# Altium schematic sheet main.SchDoc
size A0
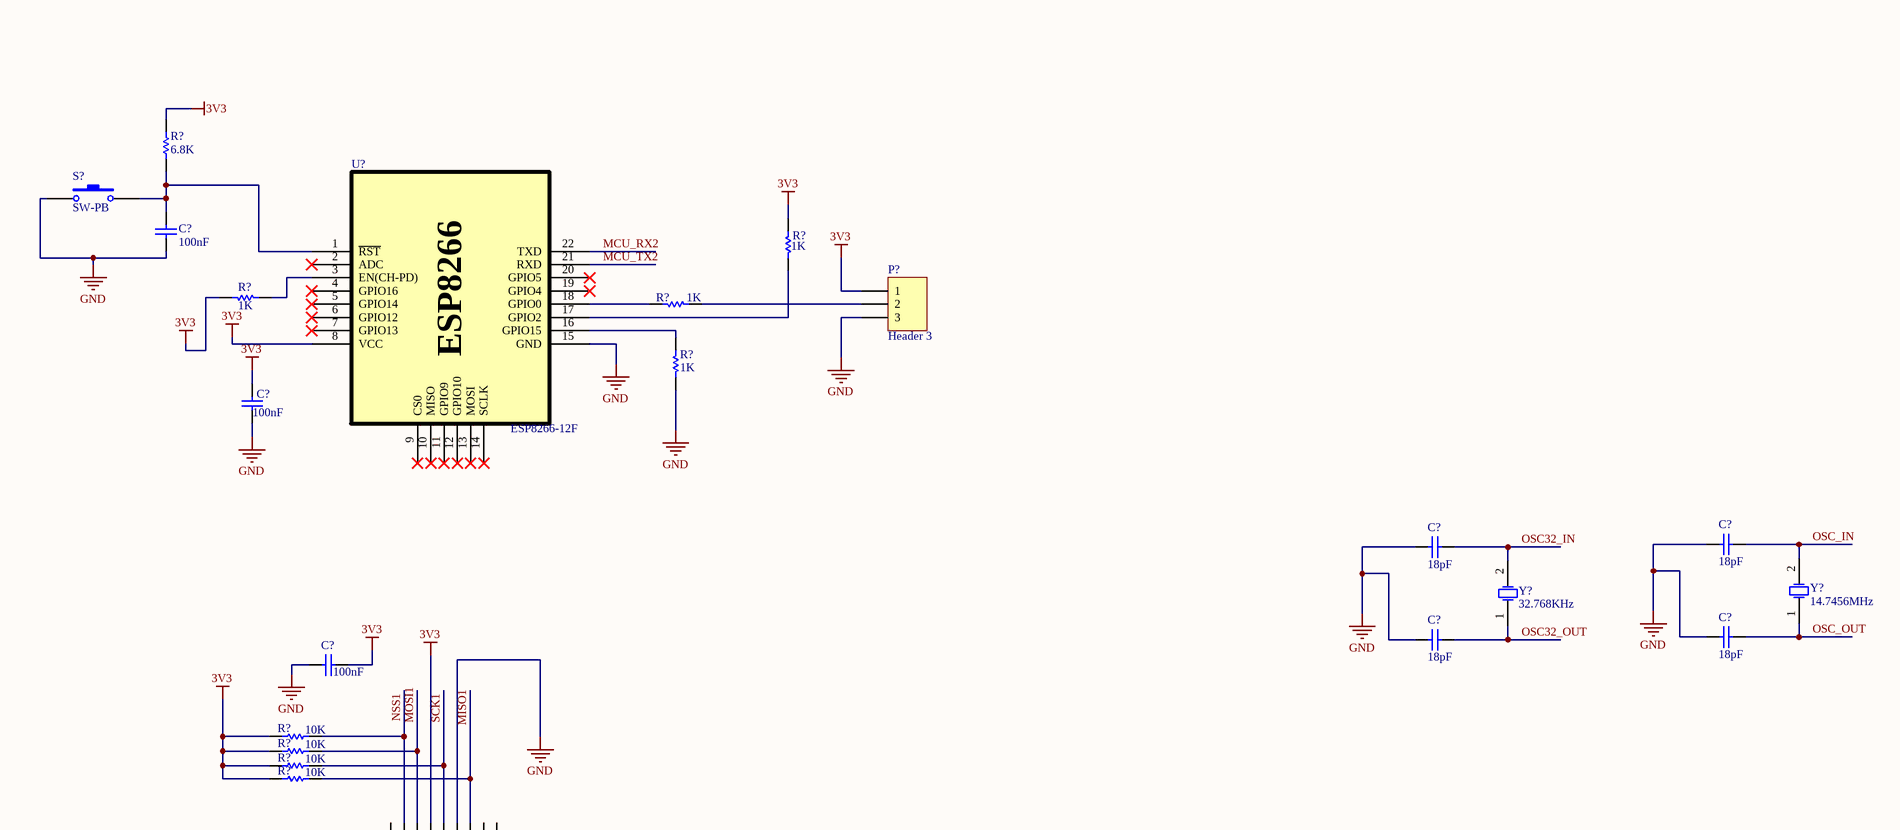
[diagram p0: main.SchDoc, top left]
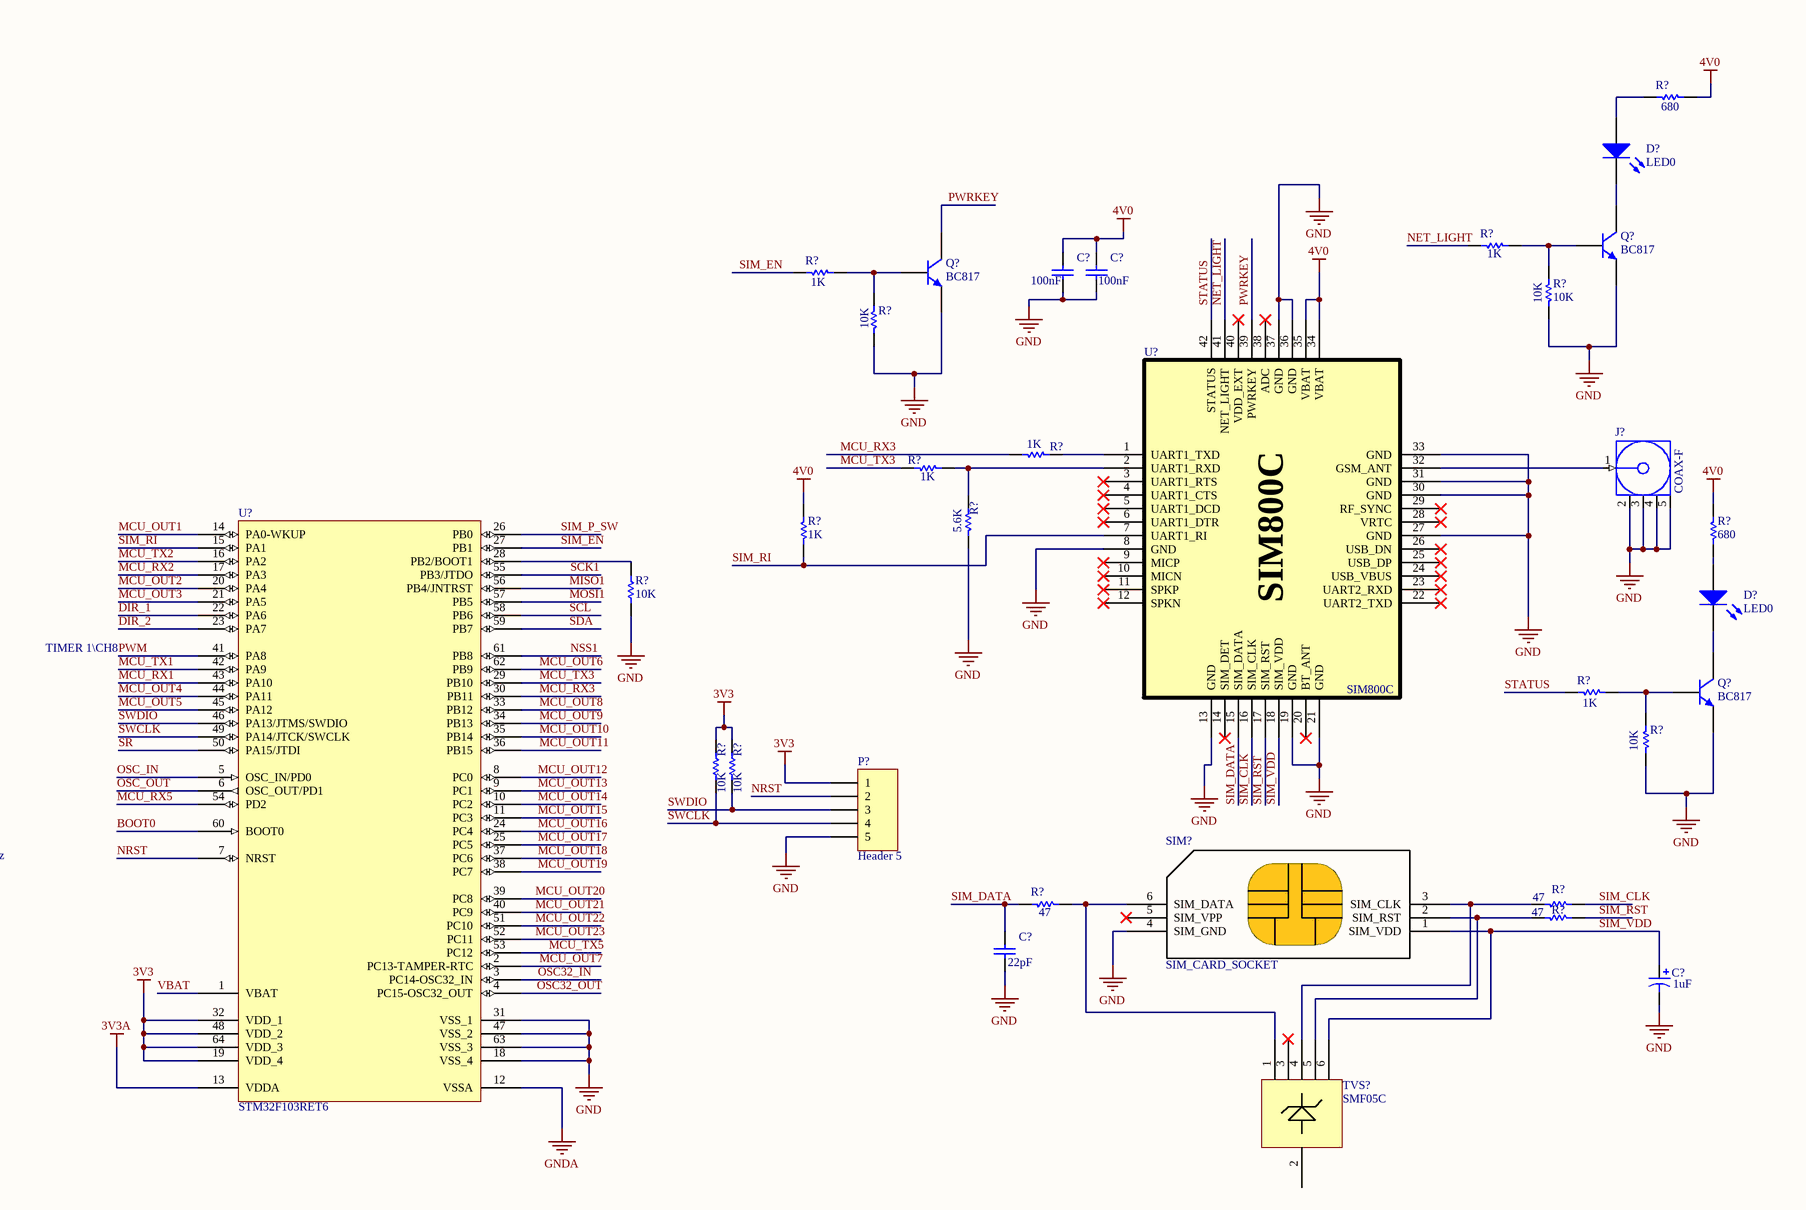
[diagram p1: main.SchDoc, top right]
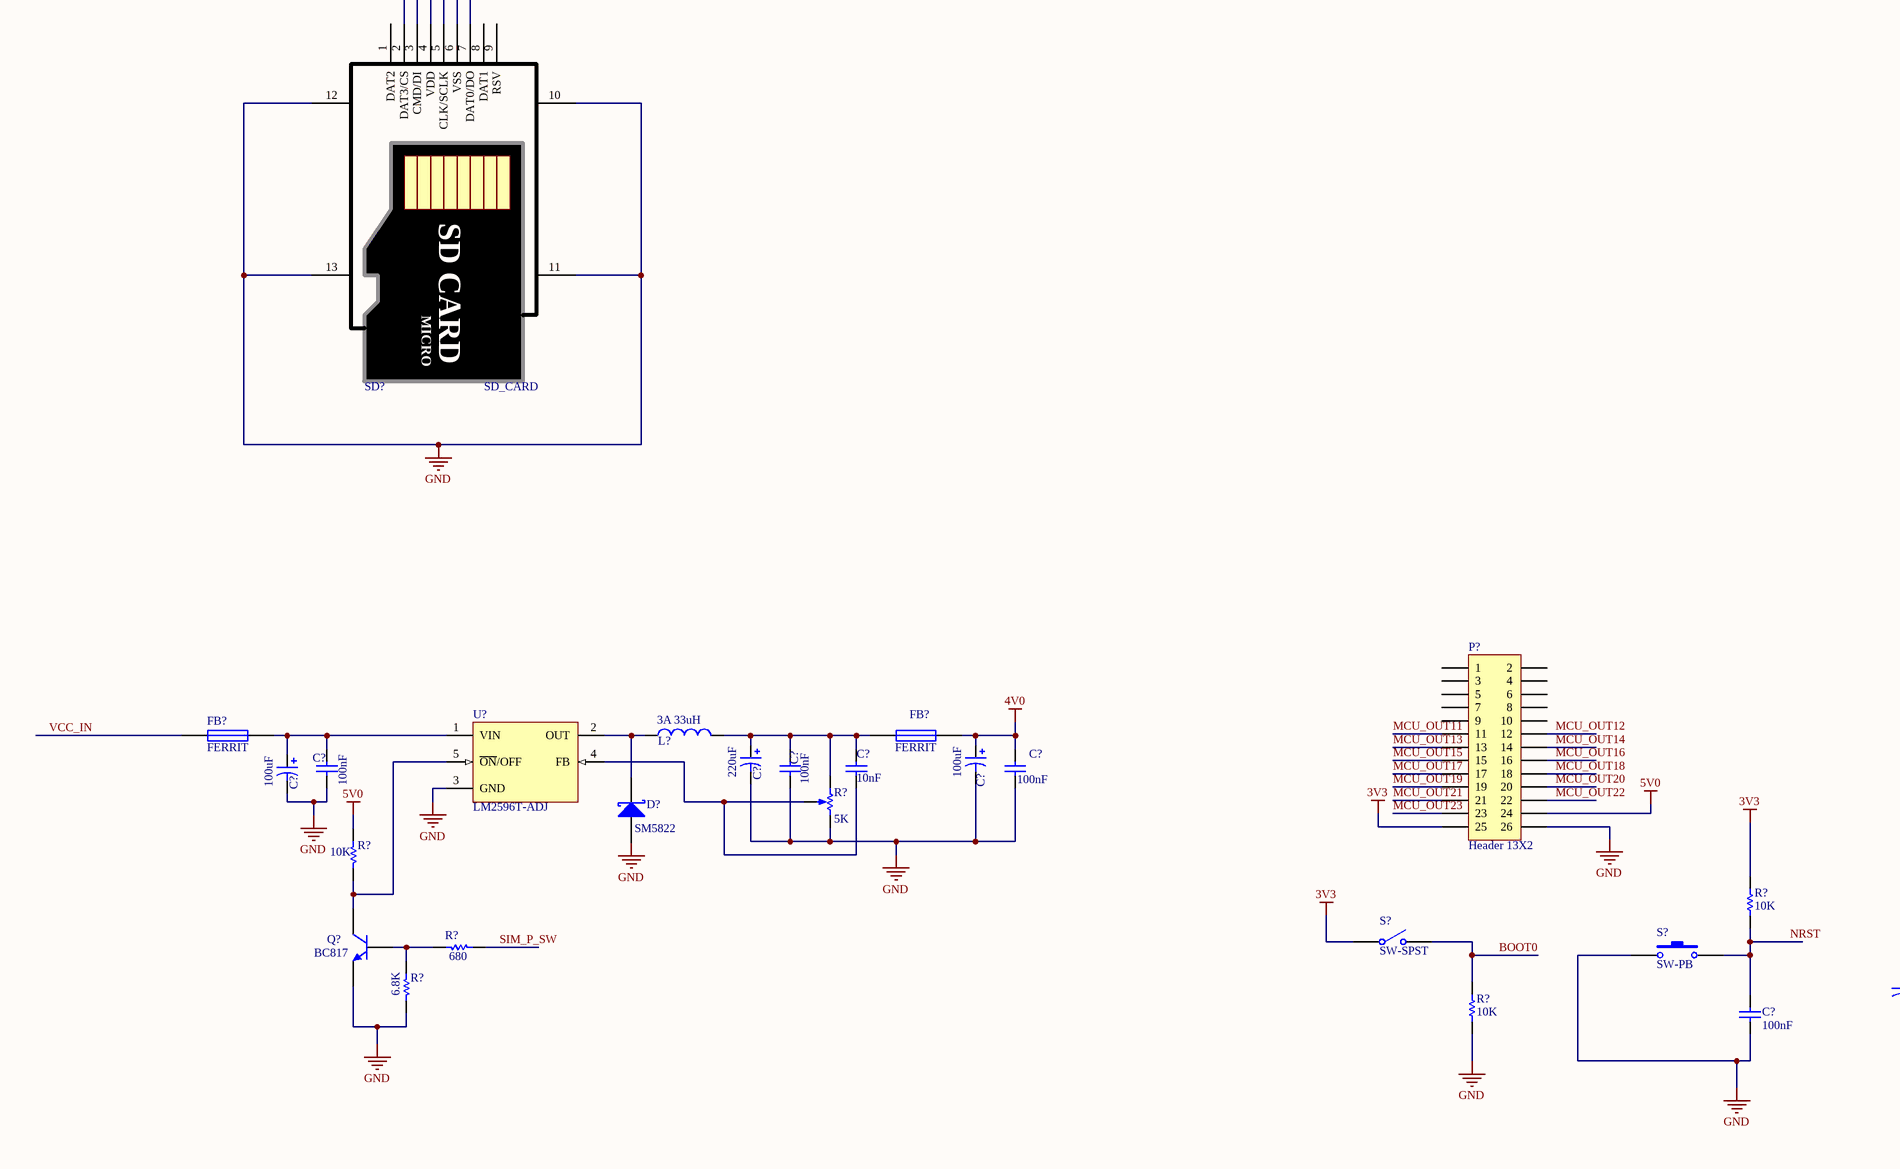
[diagram p2: main.SchDoc, bottom left]
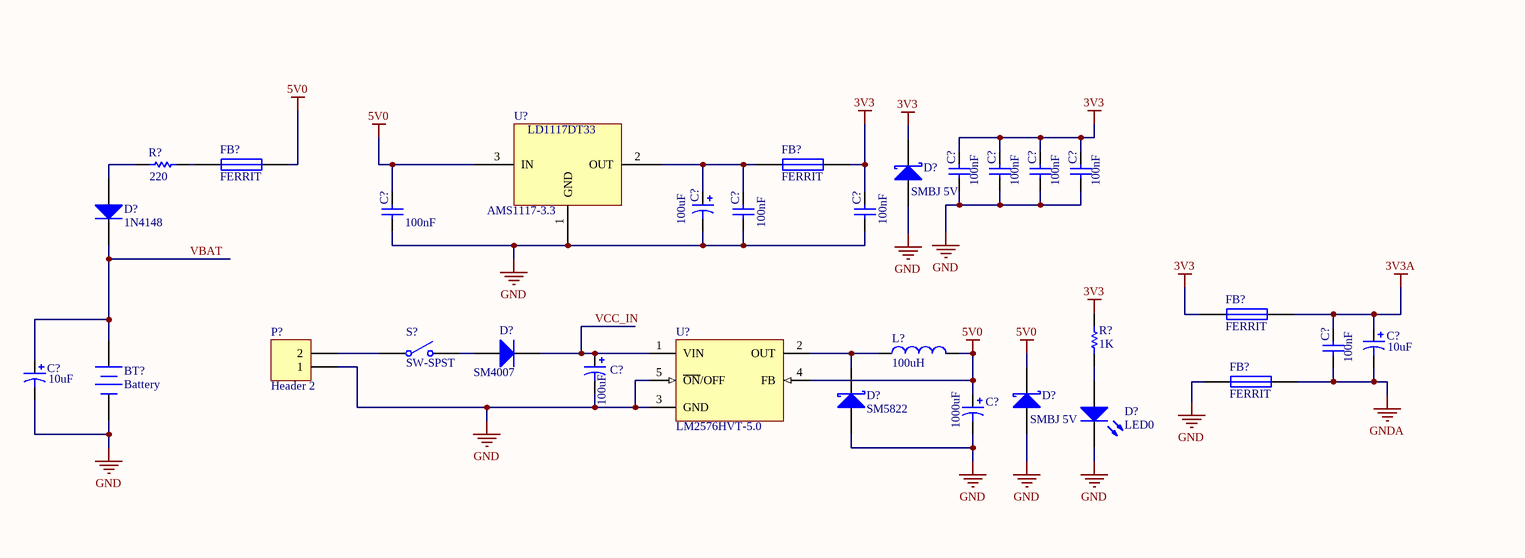
[diagram p3: main.SchDoc, bottom right]

## Parts
(Parts that share a designator on the sheet are numbered #1, #2 ... from top to bottom, then left to right.)
BT?  Battery  [CHARGING_BATT]
C?#1  100nF  [SMD_805]
C?#2  100nF  [SMD_805]
C?#3  100nF  [SMD_805]
C?#4  100nF  [SMD_805]
C?#5  18pF  [SMD_805]
C?#6  18pF  [SMD_805]
C?#7  100nF  [SMD_805]
C?#8  18pF  [SMD_805]
C?#9  18pF  [SMD_805]
C?#10  22pF  [SMD_805]
C?#11  1uF  [CAP_SMD_A]
C?#12  220uF  [c_cyl_smd]
C?#13  100uF  [c_cyl_smd2]
C?#14  100uF  [C_CYL_SMD2]
C?#15  100nF  [SMD_805]
C?#16  100nF  [SMD_805]
C?#17  10nF  [SMD_805]
C?#18  100nF  [SMD_805]
C?#19  100nF  [SMD_805]
C?#20  100nF  [SMD_805]
C?#21  100nF  [SMD_805]
C?#22  100nF  [SMD_805]
C?#23  100uF  [C_B]
C?#24  100nF  [SMD_805]
C?#25  100nF  [SMD_805]
C?#26  100nF  [SMD_805]
C?#27  10uF  [C_B]
C?#28  100nF  [SMD_805]
C?#29  100uF  [C_CYL_SMD2]
C?#30  10uF  [C_B]
C?#31  100nF  [SMD_805]
C?#32  1000uF  [c_CYL_smd]
D?#1  LED0  [SMD_805]
D?#2  LED0  [SMD_805]
D?#3  SMBJ 5V  [tvs]
D?#4  SM5822  [TVS]
D?#5  1N4148  [TVS]
D?#6  SM4007  [TVS]
D?#7  SM5822  [DO_214_AB_SMC]
D?#8  SMBJ 5V  [TVS]
D?#9  LED0  [SMD_805]
FB?#1  FERRIT  [SMD_805]
FB?#2  FERRIT  [SMD_805]
FB?#3  FERRIT  [SMD_805]
FB?#4  FERRIT  [SMD_805]
FB?#5  FERRIT  [SMD_805]
FB?#6  FERRIT  [SMD_805]
J?  COAX-F  [SMA]
L?#1  33uH  Current: 3A  [INDUC_SMD]
L?#2  100uH  [INDUC_SMD]
P?#1  Header 3  [HEADER-3P]
P?#2  Header 5  [MHDR1X5]
P?#3  Header 13X2  [header_2x13]
P?#4  Header 2  [adap_jack]
Q?#1  BC817  [SOT23]
Q?#2  BC817  [SOT23]
Q?#3  BC817  [SOT23]
Q?#4  BC817  [SOT23]
R?#1  680  [SMD_805]
R?#2  1K  [SMD_805]
R?#3  10K  [SMD_805]
R?#4  1K  [SMD_805]
R?#5  10K  [SMD_805]
R?#6  6.8K  [SMD_805]
R?#7  1K  [SMD_805]
R?#8  1K  [SMD_805]
R?#9  1K  [SMD_805]
R?#10  1K  [SMD_805]
R?#11  5.6K  [SMD_805]
R?#12  1K  [SMD_805]
R?#13  680  [SMD_805]
R?#14  1K  [SMD_805]
R?#15  10K  [SMD_805]
R?#16  1K  [SMD_805]
R?#17  1K  [SMD_805]
R?#18  10K  [SMD_805]
R?#19  10K  [SMD_805]
R?#20  10K  [SMD_805]
R?#21  47  [SMD_805]
R?#22  47  [SMD_805]
R?#23  47  [SMD_805]
R?#24  10K  [SMD_805]
R?#25  10K  [SMD_805]
R?#26  10K  [SMD_805]
R?#27  10K  [SMD_805]
R?#28  value 5K  [POT]  (hidden comment: RPot)
R?#29  220  [SMD_805]
R?#30  10K  [SMD_805]
R?#31  10K  [SMD_805]
R?#32  680  [SMD_805]
R?#33  1K  [SMD_805]
R?#34  6.8K  [SMD_805]
R?#35  10K  [SMD_805]
S?#1  SW-PB  [smd_button]
S?#2  SW-SPST  [KEY1]
S?#3  SW-PB  [smd_button]
S?#4  SW-SPST  [KEY1]
SD?  SD_CARD  [SD_CARD_HOLDER]
SIM?  SIM_CARD_SOCKET  [SIM_CARD_HOLDER]
TVS?  SMF05C  [SMF05C_6L]
U?#1  ESP8266-12F  [ESP8266_12E]
U?#2  STM32F103RET6  [LQFP64]
U?#3  SIM800C  [SIM800C_3D]
U?#4  LM2596T-ADJ  [LM2576_SMD]
U?#5  AMS1117-3.3  [SOT223]
U?#6  LM2576HVT-5.0  [LM2576_SMD]
Y?#1  32.768KHz  [xtal_rtc]
Y?#2  14.7456MHz  [xtal_smd]

## Nets
3V3: C?#4.2 C?#7.2 C?#19.2 C?#20.2 C?#21.2 C?#22.2 C?#26.2 D?#3.2(K) FB?#4.1 FB?#5.2 P?#1.1 P?#2.1 P?#3.25 R?#6.2 R?#9.1 R?#14.1 R?#19.2 R?#20.2 R?#24.1 R?#25.1 R?#26.1 R?#27.1 R?#31.2 R?#33.2 S?#2.1(COMMON) SD?.4(VDD) U?#1.8(VCC) U?#2.19(VDD_4) U?#2.32(VDD_1) U?#2.48(VDD_2) U?#2.64(VDD_3)
3V3A: C?#27.1 C?#28.2 FB?#5.1 U?#2.13(VDDA)
4V0: C?#1.2 C?#2.2 C?#13.1 C?#18.2 FB?#1.2 R?#1.2 R?#10.1 R?#13.2 U?#3.34(VBAT) U?#3.35(VBAT)
5V0: C?#24.2 C?#32.1 D?#8.2(K) FB?#3.1 L?#2.2 P?#3.24 R?#30.2 U?#5.3(IN) U?#6.4(FB)
GND: BT?.2(-) C?#1.1 C?#2.1 C?#3.1 C?#4.1 C?#5.2 C?#6.2 C?#7.1 C?#8.2 C?#9.2 C?#10.1 C?#11.2 C?#12.2 C?#13.2 C?#14.2 C?#15.1 C?#16.1 C?#18.1 C?#19.1 C?#20.1 C?#21.1 C?#22.1 C?#23.2 C?#24.1 C?#25.1 C?#26.1 C?#29.2 C?#30.2 C?#31.1 C?#32.2 D?#3.1(A) D?#4.1(A) D?#7.1(A) D?#8.1(A) D?#9.2(K) FB?#6.2 J?.2(GND) J?.3(GND) J?.4(GND) J?.5(GND) P?#1.3 P?#2.5 P?#3.26 P?#4.1 Q?#1.2(E) Q?#2.2(E) Q?#3.2(E) Q?#4.2(E) R?#3.2 R?#5.2 R?#11.1 R?#15.1 R?#16.1 R?#18.2 R?#28.2(BOT) R?#34.1 R?#35.1 S?#1.1 S?#3.1 SD?.6(VSS) SD?.10(BODY) SD?.11(BODY) SD?.12(BODY) SD?.13(BODY) SIM?.4(SIM_GND) U?#1.15(GND) U?#2.18(VSS_4) U?#2.31(VSS_1) U?#2.47(VSS_2) U?#2.63(VSS_3) U?#3.8(GND) U?#3.13(GND) U?#3.19(GND) U?#3.21(GND) U?#3.27(GND) U?#3.30(GND) U?#3.31(GND) U?#3.33(GND) U?#3.36(GND) U?#3.37(GND) U?#4.3(GND) U?#5.1(GND) U?#6.3(GND) U?#6.5(~{ON}/OFF)
GNDA: C?#27.2 C?#28.1 FB?#6.1 U?#2.12(VSSA)
BOOT0: R?#35.2 S?#2.2(NO) U?#2.60(BOOT0)
DIR_1: U?#2.22(PA6)
DIR_2: U?#2.23(PA7)
MCU_OUT1: U?#2.14(PA0-WKUP)
MCU_OUT2: U?#2.20(PA4)
MCU_OUT3: U?#2.21(PA5)
MCU_OUT4: U?#2.44(PA11)
MCU_OUT5: U?#2.45(PA12)
MCU_OUT6: U?#2.62(PB9)
MCU_OUT7: U?#2.2(PC13-TAMPER-RTC)
MCU_OUT8: U?#2.33(PB12)
MCU_OUT9: U?#2.34(PB13)
MCU_OUT10: U?#2.35(PB14)
MCU_OUT11: P?#3.11 U?#2.36(PB15)
MCU_OUT12: P?#3.12 U?#2.8(PC0)
MCU_OUT13: P?#3.13 U?#2.9(PC1)
MCU_OUT14: P?#3.14 U?#2.10(PC2)
MCU_OUT15: P?#3.15 U?#2.11(PC3)
MCU_OUT16: P?#3.16 U?#2.24(PC4)
MCU_OUT17: P?#3.17 U?#2.25(PC5)
MCU_OUT18: P?#3.18 U?#2.37(PC6)
MCU_OUT19: P?#3.19 U?#2.38(PC7)
MCU_OUT20: P?#3.20 U?#2.39(PC8)
MCU_OUT21: P?#3.21 U?#2.40(PC9)
MCU_OUT22: P?#3.22 U?#2.51(PC10)
MCU_OUT23: P?#3.23 U?#2.52(PC11)
MCU_RX1: U?#2.43(PA10)
MCU_RX2: U?#1.22(TXD) U?#2.17(PA3)
MCU_RX3: R?#7.2 U?#2.30(PB11)
MCU_RX5: U?#2.54(PD2)
MCU_TX1: U?#2.42(PA9)
MCU_TX2: U?#1.21(RXD) U?#2.16(PA2)
MCU_TX3: R?#8.2 U?#2.29(PB10)
MCU_TX5: U?#2.53(PC12)
MISO1: R?#27.2 SD?.7(DAT0/DO) U?#2.56(PB4/JNTRST)
MOSI1: R?#25.2 SD?.3(CMD/DI) U?#2.57(PB5)
NET_LIGHT: R?#2.1 U?#3.41(NET_LIGHT)
NRST: C?#31.2 P?#2.2 R?#31.1 S?#3.2 U?#2.7(NRST)
NSS1: R?#24.2 SD?.2(DAT3/CS) U?#2.61(PB8)
OSC32_IN: C?#5.1 U?#2.3(PC14-OSC32_IN) Y?#1.2(OSC2)
OSC32_OUT: C?#8.1 U?#2.4(PC15-OSC32_OUT) Y?#1.1(OSC1)
OSC_IN: C?#6.1 U?#2.5(OSC_IN/PD0) Y?#2.2(OSC2)
OSC_OUT: C?#9.1 U?#2.6(OSC_OUT/PD1) Y?#2.1(OSC1)
PWM: U?#2.41(PA8)
PWRKEY: Q?#2.3(C) U?#3.39(PWRKEY)
SCK1: R?#26.2 SD?.5(CLK/SCLK) U?#2.55(PB3/JTDO)
SCL: U?#2.58(PB6)
SDA: U?#2.59(PB7)
SIM_CLK: R?#22.2 U?#3.16(SIM_CLK)
SIM_DATA: C?#10.2 R?#21.1 U?#3.15(SIM_DATA)
SIM_EN: R?#4.1 U?#2.27(PB1)
SIM_P_SW: R?#32.2 U?#2.26(PB0)
SIM_RI: R?#10.2 U?#2.15(PA1) U?#3.7(UART1_RI)
SIM_RST: R?#23.2 U?#3.17(SIM_RST)
SIM_VDD: C?#11.1 SIM?.1(SIM_VDD) TVS?.6 U?#3.18(SIM_VDD)
SR: U?#2.50(PA15/JTDI)
STATUS: R?#17.1 U?#3.42(STATUS)
SWCLK: P?#2.4 R?#19.1 U?#2.49(PA14/JTCK/SWCLK)
SWDIO: P?#2.3 R?#20.1 U?#2.46(PA13/JTMS/SWDIO)
VBAT: BT?.1(+) C?#30.1 D?#5.2(K) U?#2.1(VBAT)
VCC_IN: C?#29.1 D?#6.2(K) FB?#2.2 U?#6.1(VIN)
NetC?#3_2: C?#3.2 R?#6.1 S?#1.2 U?#1.1(~{RST})
NetC?#12_1: C?#12.1 C?#16.2 C?#17.2 FB?#1.1 L?#1.2 R?#28.1(TOP)
NetC?#14_1: C?#14.1 C?#15.2 FB?#2.1 U?#4.1(VIN)
NetC?#17_1: C?#17.1 R?#28.3(TAP) U?#4.4(FB)
NetC?#23_1: C?#23.1 C?#25.2 FB?#4.2 U?#5.2(OUT)
NetD?#1_1: D?#1.1(A) R?#1.1
NetD?#1_2: D?#1.2(K) Q?#1.3(C)
NetD?#2_1: D?#2.1(A) R?#13.1
NetD?#2_2: D?#2.2(K) Q?#3.3(C)
NetD?#4_2: D?#4.2(K) L?#1.1 U?#4.2(OUT)
NetD?#5_1: D?#5.1(A) R?#29.2
NetD?#6_1: D?#6.1(A) S?#4.2(NO)
NetD?#7_2: D?#7.2(K) L?#2.1 U?#6.2(OUT)
NetD?#9_1: D?#9.1(A) R?#33.1
NetFB?#3_2: FB?#3.2 R?#29.1
NetJ?_1: J?.1(Signal) U?#3.32(GSM_ANT)
NetP?#1_2: P?#1.2 R?#12.1
NetP?#4_2: P?#4.2 S?#4.1(COMMON)
NetQ?#1_1: Q?#1.1(B) R?#2.2 R?#3.1
NetQ?#2_1: Q?#2.1(B) R?#4.2 R?#5.1
NetQ?#3_1: Q?#3.1(B) R?#17.2 R?#18.1
NetQ?#4_1: Q?#4.1(B) R?#32.1 R?#34.2
NetQ?#4_3: Q?#4.3(C) R?#30.1 U?#4.5(~{ON}/OFF)
NetR?#7_1: R?#7.1 U?#3.1(UART1_TXD)
NetR?#8_1: R?#8.1 R?#11.2 U?#3.2(UART1_RXD)
NetR?#9_2: R?#9.2 U?#1.17(GPIO2)
NetR?#12_2: R?#12.2 U?#1.18(GPIO0)
NetR?#14_2: R?#14.2 U?#1.3(EN(CH-PD))
NetR?#15_2: R?#15.2 U?#2.28(PB2/BOOT1)
NetR?#16_2: R?#16.2 U?#1.16(GPIO15)
NetR?#21_2: R?#21.2 SIM?.6(SIM_DATA) TVS?.1
NetR?#22_1: R?#22.1 SIM?.3(SIM_CLK) TVS?.4
NetR?#23_1: R?#23.1 SIM?.2(SIM_RST) TVS?.5

Not connected (* = marked no-connect by the designer): P?#3 1 2 3 4 5 6 7 8 9 10; SD? 1(DAT2) 8(DAT1) 9(RSV); SIM? 5(SIM_VPP)*; TVS? 2 3*; U?#1 2(ADC)* 4(GPIO16)* 5(GPIO14)* 6(GPIO12)* 7(GPIO13)* 9(CS0)* 10(MISO)* 11(GPIO9)* 12(GPIO10)* 13(MOSI)* 14(SCLK)* 19(GPIO4)* 20(GPIO5)*; U?#3 3(UART1_RTS)* 4(UART1_CTS)* 5(UART1_DCD)* 6(UART1_DTR)* 9(MICP)* 10(MICN)* 11(SPKP)* 12(SPKN)* 14(SIM_DET)* 20(BT_ANT)* 22(UART2_TXD)* 23(UART2_RXD)* 24(USB_VBUS)* 25(USB_DP)* 26(USB_DN)* 28(VRTC)* 29(RF_SYNC)* 38(ADC)* 40(VDD_EXT)*

## Notes on the sheet
- TIMER 1\CH8
- (in symbol MICRO_SD_CARD_HOLDER) SD CARD; MICRO

## Library data of the parts
BT? = Battery: Multicell Battery; Published: 24-Mar-1999; LatestRevisionDate: 17-Jul-2002; LatestRevisionNote: Re-released for DXP Platform.; PackageReference: BAT-2; Publisher: Altium Limited
C?#1-C?#10 C?#15-C?#22 C?#24-C?#26 C?#28 C?#31 = Cap: Capacitor; Published: 8-Jun-2000; LatestRevisionDate: 17-Jul-2002; LatestRevisionNote: Re-released for DXP Platform.; PackageReference: RAD-0.3; Publisher: Altium Limited
  C?#1-C?#4 C?#7 C?#15 C?#16 C?#18-C?#22 C?#24-C?#26 C?#28 C?#31: Value: 100nF
  C?#5 C?#6 C?#8 C?#9: Value: 18pF
  C?#10: Value: 22pF
  C?#17: Value: 10nF
C?#11 = Cap Pol1: Polarized Capacitor (Radial); Value: 1nF; Published: 8-Jun-2000; LatestRevisionDate: 17-Jul-2002; LatestRevisionNote: Re-released for DXP Platform.; PackageReference: RB7.6-15; Publisher: Altium Limited
C?#12-C?#14 C?#23 C?#27 C?#29 C?#30 C?#32 = Cap Pol1: Polarized Capacitor (Radial); Published: 8-Jun-2000; LatestRevisionDate: 17-Jul-2002; LatestRevisionNote: Re-released for DXP Platform.; PackageReference: RB7.6-15; Publisher: Altium Limited
  C?#12: Value: 220uF
  C?#13 C?#14 C?#23 C?#29: Value: 100uF
  C?#27 C?#30: Value: 10uF
  C?#32: Value: 1000uF
D?#1 D?#2 D?#9 = LED0: Typical INFRARED GaAs LED; Published: 8-Jun-2000; LatestRevisionDate: 08-Jul-2005; LatestRevisionNote: Mech Layer 1 removed.; PackageReference: LED-0; Publisher: Altium Limited
D?#3 D?#4 D?#7 D?#8 = Diode 11DQ03: Schottky Rectifier; Published: 8-Jun-2000; LatestRevisionDate: 17-Jul-2002; LatestRevisionNote: Re-released for DXP Platform.; DatasheetVersion: Dec-1997; PackageReference: DO-204AL; Publisher: Altium Limited; Code_JEDEC: DO-204-AL; ComponentLink1Description: Manufacturer Link; ComponentLink1URL: http://www.irf.com/; ComponentLink2Description: Datasheet; ComponentLink2URL: http://www.irf.com/product-info/datasheets/data/11dq03.pdf
D?#5 D?#6 = Diode 1N4007: 1 Amp General Purpose Rectifier; Published: 8-Jun-2000; LatestRevisionDate: 17-Jul-2002; LatestRevisionNote: Re-released for DXP Platform.; DatasheetVersion: 1998; PackageVersion: Aug-1999; PackageReference: DO-41; Publisher: Altium Limited; Code_JEDEC: DO-204-AL; ComponentLink1Description: Manufacturer Link; ComponentLink1URL: http://www.fairchildsemi.com/; ComponentLink2Description: Datasheet; ComponentLink2URL: http://www.fairchildsemi.com/ds/1N%2F1N4001.pdf
FB?#1-FB?#6 = Fuse 1: Fuse; Published: 8-Jun-2000; LatestRevisionDate: 17-Jul-2002; LatestRevisionNote: Re-released for DXP Platform.; PackageReference: PIN-W2/E2.8; Publisher: Altium Limited
J? = COAX-F: RF Coaxial PCB Connector, MCX; Thru-Hole, Right-Angle Mount Socket, Blunt Post Terminal, 50 Ohm Impedance; PCB_Layout: Complies with manufacturer's recommendation.; DrillSize: Corresponds to nominal value.; Published: 15-Jul-2004; LatestRevisionDate: 15-Jul-2004; LatestRevisionNote: Component Replaced.; DatasheetDocument: 30-May-2003; PackageDocument: 04-Jul-1999; PackageReference: 919-119J-51AX; Publisher: Altium Limited; ComponentLink1Description: Manufacturer Link; ComponentLink1URL: http://www.amphenolrf.com/
L?#1 L?#2 = Inductor: Code_IEC: 1005; Published: 8-Jun-2000; LatestRevisionDate: 29-May-2009; LatestRevisionNote: IPC-7351 Footprint Added.; PackageReference: 0402-A; Publisher: Altium Limited; PackageDescription: Chip Inductor; Code_JEITA: 0402
  L?#1: Value: 33uH
  L?#2: Value: 100uH
P?#1 = Header 3: Header, 3-Pin; LatestRevisionDate: 17-Jul-2002; LatestRevisionNote: Re-released for DXP Platform.; Publisher: Altium Limited
P?#2 = Header 5: Header, 5-Pin; LatestRevisionDate: 17-Jul-2002; LatestRevisionNote: Re-released for DXP Platform.; Publisher: Altium Limited
P?#3 = Header 13X2: Header, 13-Pin, Dual row; LatestRevisionDate: 17-Jul-2002; LatestRevisionNote: Re-released for DXP Platform.; Publisher: Altium Limited
P?#4 = Header 2: Header, 2-Pin; LatestRevisionDate: 17-Jul-2002; LatestRevisionNote: Re-released for DXP Platform.; Publisher: Altium Limited
Q?#1-Q?#3 = 2N3904: NPN General Purpose Amplifier; Published: 8-Jun-2000; LatestRevisionDate: 15-Jan-2003; LatestRevisionNote: PCB Footprint 'BCY-W3/D4.7' replaced; DatasheetVersion: 1997; PackageVersion: Sep-1998; PackageReference: TO-92A; Publisher: Altium Limited; Code_JEDEC: TO-92A; ComponentLink1Description: Manufacturer Link; ComponentLink1URL: http://www.fairchildsemi.com/; ComponentLink2Description: Datasheet; ComponentLink2URL: http://www.fairchildsemi.com/ds/2N%2F2N3904.pdf
Q?#4 = NPN: NPN Bipolar Transistor; Published: 8-Jun-2000; LatestRevisionDate: 17-Jul-2002; LatestRevisionNote: Re-released for DXP Platform.; PackageReference: TO-226; Publisher: Altium Limited; Code_JEDEC: TO-226-AA
R?#1-R?#23 R?#29-R?#35 = Res1: Resistor; Published: 8-Jun-2000; LatestRevisionDate: 17-Jul-2002; LatestRevisionNote: Re-released for DXP Platform.; PackageReference: AXIAL-0.3; Publisher: Altium Limited
  R?#1 R?#13 R?#32: Value: 680
  R?#2 R?#4 R?#7-R?#10 R?#12 R?#14 R?#16 R?#17 R?#33: Value: 1K
  R?#3 R?#5 R?#15 R?#18-R?#20 R?#30 R?#31 R?#35: Value: 10K
  R?#6 R?#34: Value: 6.8K
  R?#11: Value: 5.6K
  R?#21-R?#23: Value: 47
  R?#29: Value: 220
R?#24-R?#27 = Res1: Resistor; Value: 1K; Published: 8-Jun-2000; LatestRevisionDate: 17-Jul-2002; LatestRevisionNote: Re-released for DXP Platform.; PackageReference: AXIAL-0.3; Publisher: Altium Limited
R?#28 = RPot: Potentiometer; Sim Note: Enter the Resistance value and the set point into parameter fields.; Set Position: 0.5; Published: 8-Jun-2000; LatestRevisionDate: 17-Jul-2002; LatestRevisionNote: Re-released for DXP Platform.; PackageReference: VR5; Publisher: Altium Limited
S?#1 S?#3 = SW-PB: Switch; Published: 24-Mar-1999; LatestRevisionDate: 17-Jul-2002; LatestRevisionNote: Re-released for DXP Platform.; PackageReference: SPST-2; Publisher: Altium Limited
S?#2 S?#4 = SW-SPST: Single-Pole, Single-Throw Switch; Published: 24-Mar-1999; LatestRevisionDate: 17-Jul-2002; LatestRevisionNote: Re-released for DXP Platform.; PackageReference: SPST-2; Publisher: Altium Limited
SD? = MICRO_SD_CARD_HOLDER
TVS? = TVS_ARRAY
U?#1 = ESP8266
U?#2 = STM32F103R8T6: STM32 ARM-based 32-bit MCU with 64 Kbytes Flash, 64-pin LQFP, Industrial Temperature; Published: 30-May-2008; DatasheetVersion: rev6, Mar-2008; PackageVersion: Mar-2008; PackageReference: LQFP64; Publisher: Altium Limited; PackageDescription: 64-Pin Low-Profile Quad Flat Pack, 10 x 10 mm Body, 0.5 mm Pitch (LQFP64); ComponentLink1Description: Manufacturer Link; ComponentLink1URL: www.st.com/stm32; ComponentLink2Description: Datasheet; ComponentLink2URL: http://www.st.com/stonline/products/literature/ds/13587.pdf
U?#4 = LM2596T-ADJ: SIMPLE SWITCHER Power Converter 150 KHz 3A Step-Down Voltage Regulator; Manufacturer: National Semiconductor; PackageTopMarking: NSUZXYTT*LM2596T*-ADJ P+; PowerWise: N; Published: 4-Dec-2008; DatasheetVersion: May-2002; PackageVersion: revA, Oct-1989; PackageReference: T05D; Publisher: Altium Limited; PackageDescription: TO-220, Molded, Stagger Bend, 5 Lead; CompType: Switcher; PartNumber: LM2596T-ADJ; RoHS: O; PinCount: 5; DigiKeyPartNumber: LM2596T-ADJ-ND; ComponentLink1Description: LM2596 Datasheet; ComponentLink1URL: http://www.national.com/ds/LM/LM2596.pdf; ComponentLink2Description: LM2596 Web Page; ComponentLink2URL: http://www.national.com/pf/LM/LM2596.html; ComponentLink3Description: T05D Package Page; ComponentLink3URL: http://www.national.com/packaging/folders/t05d.html
U?#5 = LD1117DT33
U?#6 = LM2576HVT-5.0: SIMPLE SWITCHER; 3A Step-Down Voltage Regulator; Manufacturer: National Semiconductor; PackageTopMarking: NSUZXYTT*LM2576HVT*-5.0 P+; PowerWise: N; Published: 4-Dec-2008; DatasheetVersion: Aug-2004; PackageVersion: revJ, Jan-1992; PackageReference: T05A; Publisher: Altium Limited; PackageDescription: TO-220, Molded, 5 Lead, Straight; CompType: Switcher; PartNumber: LM2576HVT-5.0; RoHS: O; PinCount: 5; DigiKeyPartNumber: LM2576HVT-5.0-ND; Code_JEDEC: TO-220-AB; ComponentLink1Description: LM2576HV Datasheet; ComponentLink1URL: http://www.national.com/ds/LM/LM2576HV.pdf; ComponentLink2Description: LM2576HV Web Page; ComponentLink2URL: http://www.national.com/pf/LM/LM2576HV.html; ComponentLink3Description: T05A Package Page; ComponentLink3URL: http://www.national.com/packaging/folders/t05a.html
Y?#1 Y?#2 = XTAL: Crystal Oscillator; Published: 8-Jun-2000; LatestRevisionDate: 17-Jul-2002; LatestRevisionNote: Re-released for DXP Platform.; PackageReference: R38; Publisher: Altium Limited